# EAGLE design RetroBoard (EAGLE 6.1)
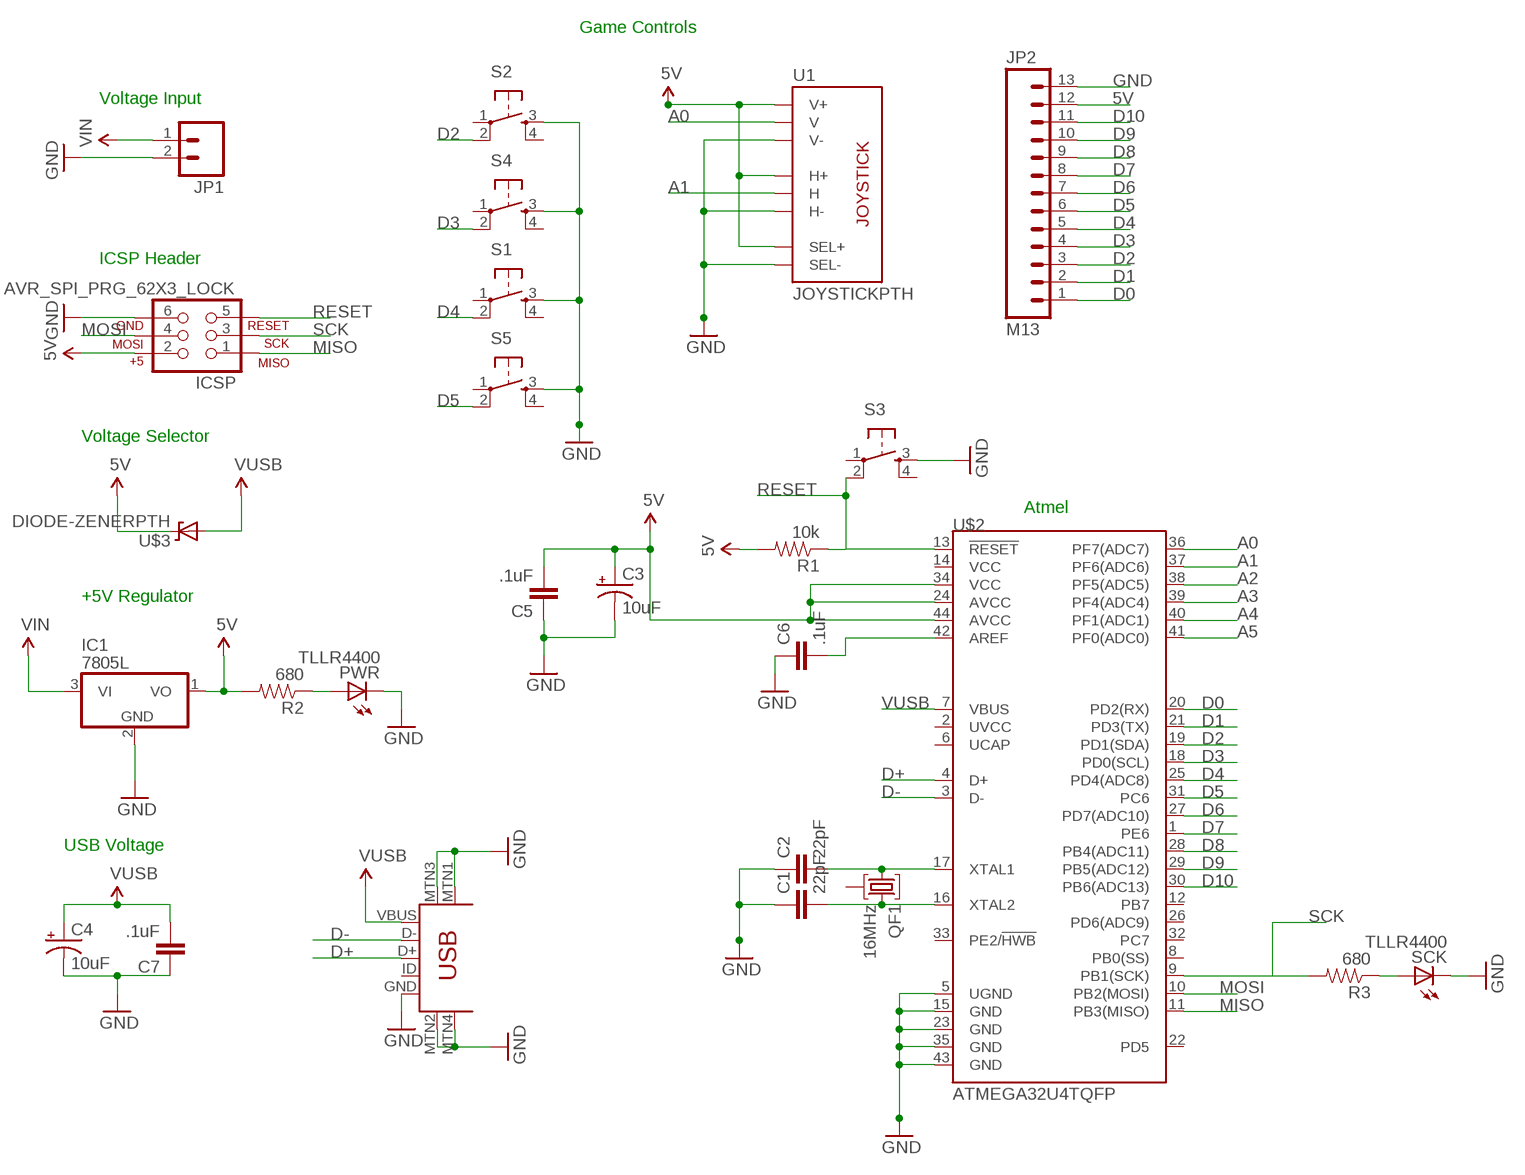
[diagram p0: schematic, sheet 1]

## Parts
C1  22pF  CAPEZ  [CAP-PTH-SMALLEZ]
C2  22pF  CAPEZ  [CAP-PTH-SMALLEZ]
C3  10uF  CAP_POLPTH4  [CPOL-RADIAL-1000UF-25V]
C4  10uF  CAP_POLPTH4  [CPOL-RADIAL-1000UF-25V]
C5  .1uF  CAPEZ  [CAP-PTH-SMALLEZ]
C6  .1uF  CAPEZ  [CAP-PTH-SMALLEZ]
C7  .1uF  CAPEZ  [CAP-PTH-SMALLEZ]
IC1  7805L  [TO92]
ICSP  AVR_SPI_PRG_62X3_LOCK  [2X3_LOCK]
JP1  M02LOCK  [1X02_LOCK]
JP2  M13  [1X13]
PWR  TLLR4400  [LED3MM]
QF1  16MHz  IXFA  [HC49U]
R1  10k  RESISTORAXIAL-0.3  [AXIAL-0.3]
R2  680  RESISTORAXIAL-0.3  [AXIAL-0.3]
R3  680  RESISTORAXIAL-0.3  [AXIAL-0.3]
S1  TAC_SWITCHSMD  [TACTILE_SWITCH_SMD]
S2  TAC_SWITCHPTH  [TACTILE-PTH]
S3  TAC_SWITCHPTH  [TACTILE-PTH]
S4  TAC_SWITCHPTH  [TACTILE-PTH]
S5  TAC_SWITCHPTH  [TACTILE-PTH]
SCK  TLLR4400  [LED3MM]
U1  JOYSTICKPTH  [JOYSTICK]
U$2  ATMEGA32U4TQFP  [SPARKFUN-DIGITALIC_TQFP44]
U$3  DIODE-ZENERPTH  [DIODE-ZENER]
USB  USB-MINIB-5PIN  [USB-MINIB]

## Nets
5V: C3.1(+) C5.2 IC1.1(VO) ICSP.2 JP2.12 R1.P$2 R2.P$2 U1.B1A(SEL+) U1.H1(H+) U1.V1(V+) U$2.24(AVCC) U$2.34(VCC) U$2.44(AVCC) U$3.P$1(C)
A0: U1.V2(V) U$2.36(PF7(ADC7))
A1: U1.H2(H) U$2.37(PF6(ADC6))
A2: U$2.38(PF5(ADC5))
A3: U$2.39(PF4(ADC4))
A4: U$2.40(PF1(ADC1))
A5: U$2.41(PF0(ADC0))
D0: JP2.1 U$2.20(PD2(RX))
D1: JP2.2 U$2.21(PD3(TX))
D2: JP2.3 S2.2 U$2.19(PD1(SDA))
D3: JP2.4 S4.2 U$2.18(PD0(SCL))
D4: JP2.5 S1.2 U$2.25(PD4(ADC8))
D5: JP2.6 S5.2 U$2.31(PC6)
D6: JP2.7 U$2.27(PD7(ADC10))
D7: JP2.8 U$2.1(PE6)
D8: JP2.9 U$2.28(PB4(ADC11))
D9: JP2.10 U$2.29(PB5(ADC12))
D10: JP2.11 U$2.30(PB6(ADC13))
D+: U$2.4(D+) USB.D+
D-: U$2.3(D-) USB.D-
GND: C1.1 C2.1 C3.2(-) C4.2(-) C5.1 C6.1 C7.1 IC1.2(GND) ICSP.6 JP1.2 JP2.13 PWR.K(C) S1.3 S2.3 S3.3 S4.3 S5.3 SCK.K(C) U1.B2A(SEL-) U1.H3(H-) U1.V3(V-) U$2.5(UGND) U$2.15(GND) U$2.23(GND) U$2.35(GND) U$2.43(GND) USB.GND USB.MTN1(MTN2) USB.MTN2(MTN3) USB.MTN3(MTN1) USB.MTN4
MISO: ICSP.1 U$2.11(PB3(MISO))
MOSI: ICSP.4 U$2.10(PB2(MOSI))
N$2: PWR.A R2.P$1
N$10: C2.2 QF1.1 U$2.17(XTAL1)
N$11: C1.2 QF1.3 U$2.16(XTAL2)
N$13: C6.2 U$2.42(AREF)
N$14: R3.P$1 SCK.A
RESET: ICSP.5 R1.P$1 S3.2 U$2.13(!RESET)
SCK: ICSP.3 R3.P$2 U$2.9(PB1(SCK))
VIN: C4.1(+) C7.2 IC1.3(VI) JP1.1 U$3.P$2(A) USB.VBUS ; supply symbol labelled VUSB
VUSB: U$2.7(VBUS)
Unconnected: QF1.2 S1.1 S1.4 S2.1 S2.4 S3.1 S3.4 S4.1 S4.4 S5.1 S5.4 U$2.2(UVCC) U$2.6(UCAP) U$2.8(PB0(SS)) U$2.12(PB7) U$2.14(VCC) U$2.22(PD5) U$2.26(PD6(ADC9)) U$2.32(PC7) U$2.33(PE2/!HWB) USB.ID

## Notes on the sheet
- Game Controls
- Voltage Input
- ICSP Header
- Voltage Selector
- Atmel
- +5V Regulator
- USB Voltage

## Library data of the parts
C1 C2 C5-C7 = SparkFun-Capacitors:CAP: Capacitor Standard 0603 ceramic capacitor, and 0.1" leaded capacitor.
C3 C4 = SparkFun-Passives:CAP_POL: Capacitor Polarized These are standard SMD and PTH capacitors. Normally 10uF, 47uF, and 100uF in electrolytic and tantalum varieties. Always verify the external diameter of the through hole cap, it varies with capacity, voltage, and manufacturer. The EIA devices should be standard.
IC1 = linear:78*: Positive VOLTAGE REGULATOR Source: http://cache.national.com/ds/LM/LM78L05.pdf http://www.fairchildsemi.com/ds/LM/LM7805.pdf
ICSP = SparkFun-Connectors:AVR_SPI_PRG_6: AVR ISP 6 Pin This is the reduced ISP connector for AVR programming. Common on Arduino. This footprint will take up less PCB space and can be used with a 10-pin to 6-pin adapter such as SKU: BOB-08508
JP1 = SparkFun-Connectors:M02: Header 2 Standard 2-pin 0.1" header. Use with straight break away headers (SKU : PRT-00116), right angle break away headers (PRT-00553), swiss pins (PRT-00743), machine pins (PRT-00117), and female headers (PRT-00115). Molex polarized connector foot print use with SKU : PRT-08233 with associated crimp pins and housings.
JP2 = SparkFun-Connectors:M13: 13-pin single row .1" header
PWR SCK = led:TLLR4400: Low Current (2mA) LED 3 mm Tinted Diffused Package color RED Source: Data sheet <http://www.farnell.com/datasheets/391100.pdf>; MF: VISHAY SEMICONDUCTOR; OC_FARNELL: 1612437
QF1 = crystal:IXF: Crystal Filter Source: www.ilsiamerica.com .. C1 IXF Series.pdf; OC_FARNELL: unknown; OC_NEWARK: unknown
R1-R3 = SparkFun-Passives:RESISTOR: Resistor Basic schematic elements and footprints for 0603, 1206, and PTH resistors.
S1 = SparkFun-Electromechanical:TAC_SWITCH: Momentary Switch Button commonly used for reset or general input. Spark Fun Electronics SKU : COM-00097 SMT- SWCH-08247; PROD_ID: SWCH-08247
S2-S5 = SparkFun-Electromechanical:TAC_SWITCH: Momentary Switch Button commonly used for reset or general input. Spark Fun Electronics SKU : COM-00097 SMT- SWCH-08247
U1 = SparkFun-Electromechanical:JOYSTICK: Thumb Joystick Joystick commonly found in PS2 controllers. Two pots and a select switch. Footprint proven. Spark Fun Electronics SKU : COM-09032
U$2 = SparkFun-DigitalIC:ATMEGA32U4: Atmel 44-pin 8-bit Microcontroller with 32KBytes of ISP Flash and USB Controller
U$3 = SparkFun-DiscreteSemi:DIODE-ZENER: Zener Diode Production Part - 8199 3.4V Zener Voltage
USB = SparkFun-Connectors:USB-MINIB: Mini-USB "B" connector with 5th pin broken out. Created new symbol breaking out 5th "ID" pin in mini/micro USB connector spec. See: http://en.wikipedia.org/wiki/Mini_usb#Cables. Uses same footprint as 4-pin symbol. Also added pins to connect to mounting / shield pads if required (probably not generally needed as signals aren't shielded once they leave the connector).

## Net classes
0 default: width 0.305 mm, drill 0.508 mm, clearance 0.254 mm

## Board
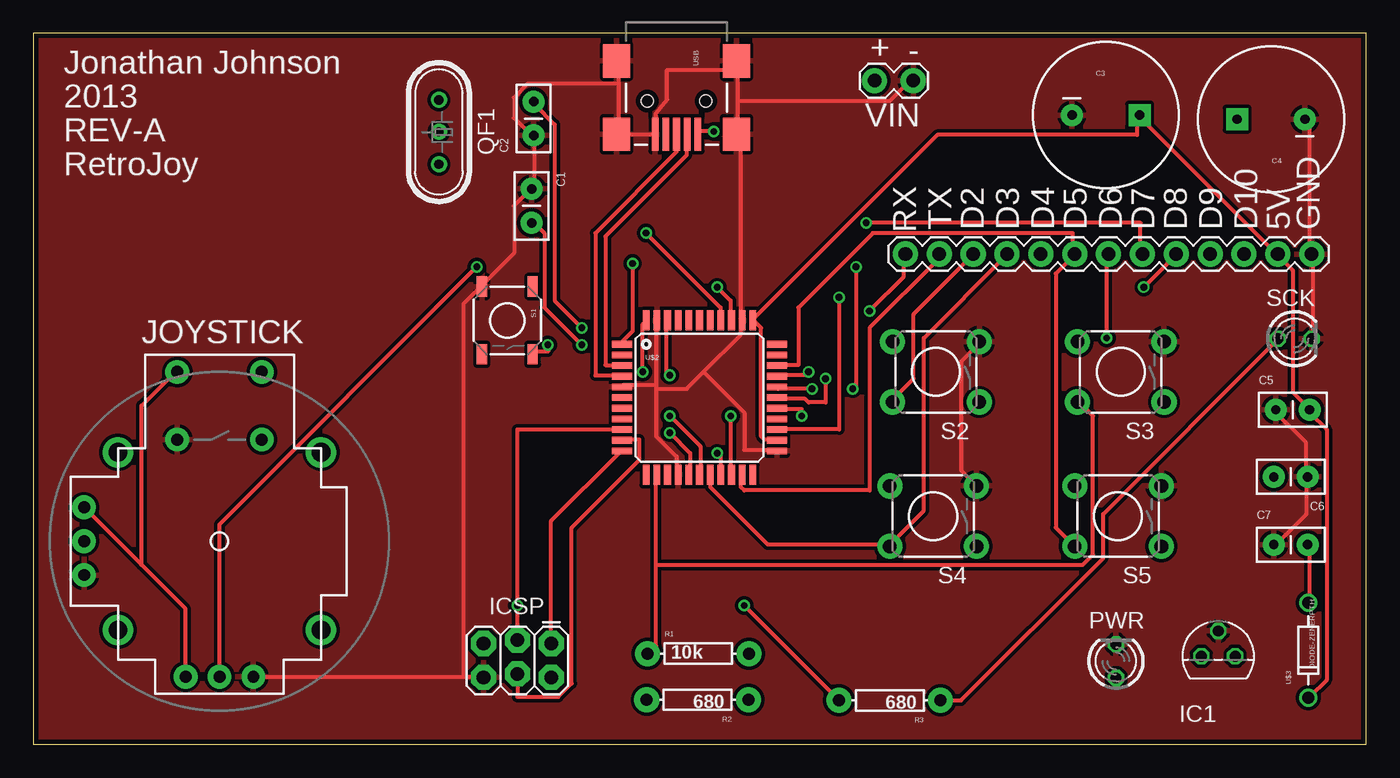
[diagram p1: board, top side]
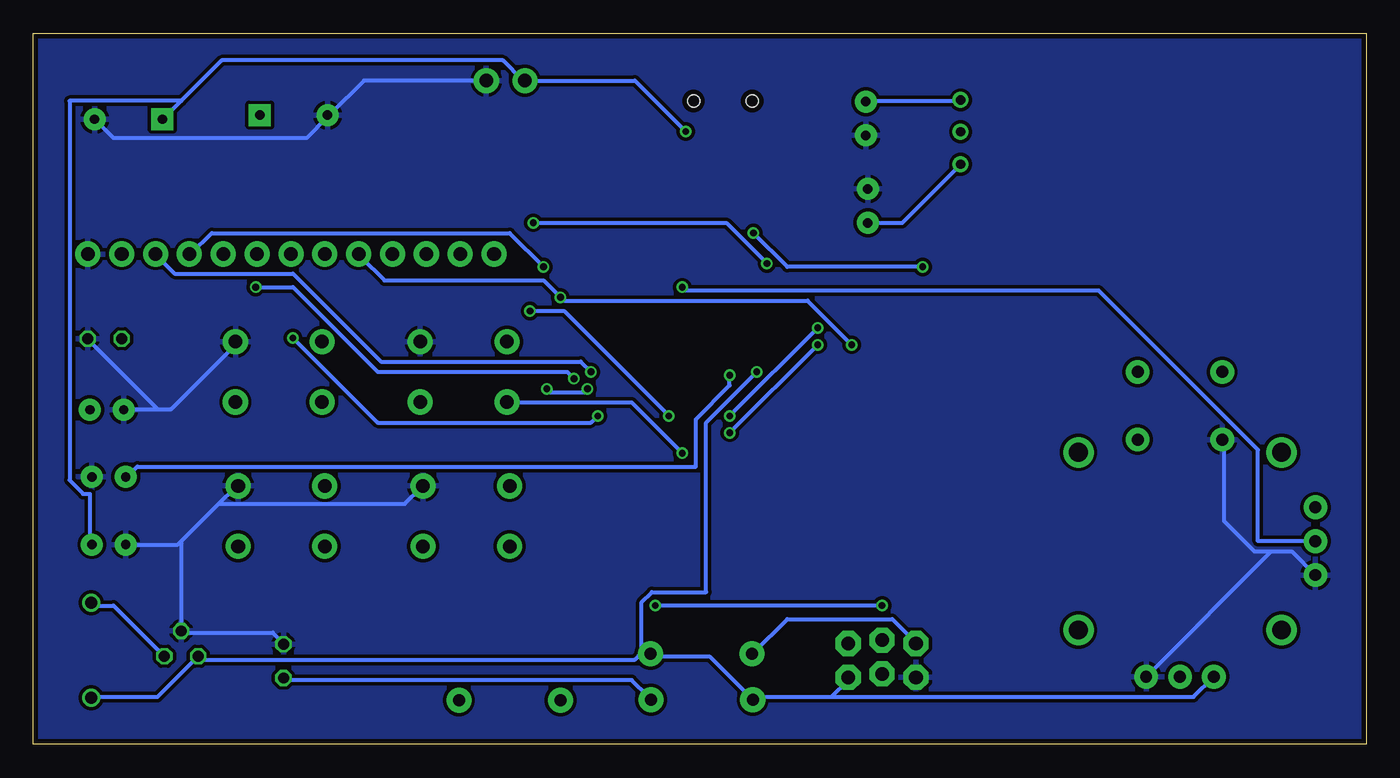
[diagram p2: board, bottom side, seen from below]

Size 100 x 53.33 mm. Coordinates in mm from the lower left corner, seen from the top.
Outline: 0,0 100,0 100,53.33 0,53.33 0,0
Copper layers (1*16): Top 0.0356mm / dielectric 1.5011mm / Bottom 0.0356mm
Design rules: minimum track width 6mil, minimum drill 13mil, track to track 6mil, track to pad 6mil, pad to pad 6mil, via to via 6mil, smd to smd 6mil, copper to edge 15mil, drill to drill 6mil, minimum pad ring 7mil, minimum via ring 7mil, stop-mask expansion 3mil, vias tented up to drill 0mil, thermal gap 10mil

### Footprints (pad centres in the part's own frame; a part is rotated, then mirrored left to right if it is on the bottom)
CAP-PTH-SMALLEZ = drill 0.7 pad 1.651: 1 0,0; 2 2.54,0
CPOL-RADIAL-1000UF-25V = drill 0.7 pad 1.651 square: 1 2.54,0 | drill 0.7 pad 1.651: 2 -2.54,0
TO92 = drill 0.813 octagon: 1 -1.27,0; 2 0,1.905; 3 1.27,0
2X3_LOCK = drill 1.016 pad 1.88 octagon: 1 0,0; 2 0,2.54; 3 2.54,-0.254; 4 2.54,2.286; 5 5.08,0; 6 5.08,2.54
1X02_LOCK = drill 1.016 pad 1.88: 1 -0.178,0; 2 2.718,0
1X13 = drill 1.016 pad 1.88: 1 0,0; 2 2.54,0; 3 5.08,0; 4 7.62,0; 5 10.16,0; 6 12.7,0; 7 15.24,0; 8 17.78,0; 9 20.32,0; 10 22.86,0; 11 25.4,0; 12 27.94,0; 13 30.48,0
LED3MM = drill 0.813 octagon: A -1.27,0; K 1.27,0
HC49U = drill 0.7 pad 1.2: 1 -2.413,0; 2 -0.027,0; 3 2.413,0
AXIAL-0.3 = drill 0.9 pad 1.88: P$1 -3.81,0; P$2 3.81,0
TACTILE_SWITCH_SMD = smd 1.524 x 0.762: 1 -2.54,1.905; 2 2.54,1.905; 3 -2.54,-1.905; 4 2.54,-1.905
TACTILE-PTH = drill 1.016 pad 1.88: 1 -3.251,2.261; 2 3.251,2.261; 3 -3.251,-2.261; 4 3.251,-2.261
JOYSTICK = drill 0.9 pad 1.778: B1A -3.175,12.7; B1B 3.175,12.7; B2A -3.175,7.62; B2B 3.175,7.62 | drill 0.889 pad 1.778: H1 -2.54,-10.16; H2 0,-10.16; H3 2.54,-10.16; V1 -10.16,2.54; V2 -10.16,0; V3 -10.16,-2.54 | drill 1.397 pad 2.286: MOUNT1 -7.62,6.668; MOUNT2 -7.62,-6.668; MOUNT3 7.62,-6.668; MOUNT4 7.62,6.668
SPARKFUN-DIGITALIC_TQFP44 = smd 1.5 x 0.5: 1 -5.8,4; 2 -5.8,3.2; 3 -5.8,2.4; 4 -5.8,1.6; 5 -5.8,0.8; 6 -5.8,0; 7 -5.8,-0.8; 8 -5.8,-1.6; 9 -5.8,-2.4; 10 -5.8,-3.2; 11 -5.8,-4; 23 5.8,-4; 24 5.8,-3.2; 25 5.8,-2.4; 26 5.8,-1.6; 27 5.8,-0.8; 28 5.8,0; 29 5.8,0.8; 30 5.8,1.6; 31 5.8,2.4; 32 5.8,3.2; 33 5.8,4 | smd 0.5 x 1.5: 12 -4,-5.8; 13 -3.2,-5.8; 14 -2.4,-5.8; 15 -1.6,-5.8; 16 -0.8,-5.8; 17 0,-5.8; 18 0.8,-5.8; 19 1.6,-5.8; 20 2.4,-5.8; 21 3.2,-5.8; 22 4,-5.8; 34 4,5.8; 35 3.2,5.8; 36 2.4,5.8; 37 1.6,5.8; 38 0.8,5.8; 39 0,5.8; 40 -0.8,5.8; 41 -1.6,5.8; 42 -2.4,5.8; 43 -3.2,5.8; 44 -4,5.8
DIODE-ZENER = drill 0.9: P$1 -3.556,0; P$2 3.556,0
USB-MINIB = smd 2.5 x 0.5: D+ 2.5,0; D- 2.5,0.8; GND 2.5,-1.6; ID 2.5,-0.8; VBUS 2.5,1.6 | smd 2.5 x 2: MTN1 -3,4.5; MTN2 2.5,4.5; MTN3 -3,-4.5; MTN4 2.5,-4.5 | hole 0.9: 0,2.2; 0,-2.2

### Placement (x,y rotation side)
C1  37.39,41.66 270 top
C2  37.54,45.67 90 top
C3  80.47,47.19 0 top
C4  92.86,46.89 180 top
C5  93.22,25.1 0 top
C6  95.61,20.07 180 top
C7  93.07,14.99 0 top
IC1  88.9,6.6 0 top
ICSP  38.86,7.57 180 top
JP1  63.3,49.78 0 top
JP2  65.43,36.78 0 top
PWR  81.23,6.25 90 top
QF1  30.43,45.92 270 top
R1  49.89,6.81 0 top
R2  49.83,3.35 180 top
R3  64.26,3.3 180 top
S1  35.56,31.8 270 top
S2  67.72,27.94 180 top
S3  81.58,27.94 180 top
S4  67.51,17.12 180 top
S5  81.38,17.12 180 top
SCK  94.64,30.43 0 top
U1  13.97,15.24 0 top
U$2  49.99,26.01 0 top
U$3  95.66,7.06 90 top
USB  48.26,48.26 270 top

### Tracks (layer width: path | path; a pad name or v marks a point on that pad's centre or on a via)
5V  (via drill 0.51)
  Top 0.305: 8.13,13.46 11.43,10.16 U1.H1 | 8.13,13.46 U1.V1 | 8.13,13.46 8.13,25.4 10.67,27.94 U1.B1A | v45.72,27.94 45.72,31.5 45.97,31.75 U$2.44 | U$2.24 55.63,22.86 54.86,22.86 54.61,23.11 54.61,31.24 54.1,31.75 U$2.34 54.1,32 67.82,45.72 82.8,45.72 82.8,46.99 C3.1 83.06,46.99 93.22,36.83 JP2.12 93.47,36.58 94.49,35.56 94.49,26.42 95.76,25.15 C5.2 95.76,24.89 97.03,23.62 97.03,4.83 95.76,3.56 U$3.P$1
  Bottom 0.305: 40.13,3.56 38.86,4.83 ICSP.2 | 40.13,3.56 45.97,3.56 R2.P$2 46.23,3.56 49.28,6.6 53.59,6.6 R1.P$2 | v45.72,27.94 49.53,24.13 49.53,11.43 53.59,11.43 54.36,10.67 54.36,6.86 | 54.36,6.86 53.85,6.86 R1.P$2 | U1.H1 12.95,3.56 40.13,3.56 | 87.88,6.35 90.68,3.56 95.5,3.56 U$3.P$1 | 87.88,6.35 IC1.1 87.88,6.35 | 54.36,6.86 54.86,6.35 87.88,6.35 | 54.36,6.86 R1.P$2
A0  (via drill 0.51)
  Top 0.305: v51.31,34.29 52.32,33.27 52.32,32 U$2.36
  Bottom 0.305: v51.31,34.29 51.05,34.04 20.07,34.04 8.13,22.1 8.13,15.24 U1.V2
A1  (via drill 0.51)
  Top 0.305: v45.97,38.35 51.56,32.77 51.56,32 U$2.37 | v33.27,35.81 13.97,16.51 U1.H2
  Bottom 0.305: v45.97,38.35 43.43,35.81 v33.27,35.81
D0  (via drill 0.51)
  Top 0.305: v52.32,24.64 52.32,20.32 U$2.20 | v62.74,32.51 65.28,35.05 65.28,36.58 JP2.1
  Bottom 0.305: v52.32,24.64 60.2,32.51 v62.74,32.51
D1
  Top 0.305: U$2.21 53.09,20.07 53.09,19.3 53.34,19.05 62.74,19.05 62.74,31.24 67.82,36.32 67.82,36.58 JP2.2
D2  (via drill 0.51)
  Top 0.305: v51.31,21.84 51.56,21.59 51.56,20.32 U$2.19 | JP2.3 70.36,36.58 66.04,32.26 66.04,27.43 64.52,25.91 S2.2
  Bottom 0.305: v51.31,21.84 55.12,25.65 64.26,25.65 S2.2
D3
  Top 0.305: 64.26,14.99 55.12,14.99 50.8,19.3 50.8,20.07 U$2.18 | 64.26,14.99 S4.2 64.26,14.99 | 64.26,14.99 66.8,17.53 66.8,30.48 72.9,36.58 JP2.4
D4  (via drill 0.51)
  Top 0.305: v60.45,33.53 60.45,23.62 55.88,23.62 U$2.25 | v38.61,29.97 38.61,29.46 37.59,29.46 S1.2
  Bottom 0.305: JP2.5 75.44,36.58 73.66,34.8 61.72,34.8 v60.45,33.53 60.2,33.27 41.91,33.27 v38.61,29.97
D5
  Top 0.305: U$2.31 55.88,28.45 57.4,28.45 57.4,32.77 62.99,38.35 77.98,38.35 77.98,36.83 JP2.6 77.98,36.58 76.71,35.31 76.71,16.26 77.98,14.99 S5.2
D6  (via drill 0.51)
  Top 0.305: v57.66,24.64 57.66,25.15 55.88,25.15 U$2.27 | v80.52,30.48 80.52,36.58 JP2.7
  Bottom 0.305: v57.66,24.64 58.17,24.13 74.17,24.13 v80.52,30.48
D7  (via drill 0.51)
  Top 0.305: v44.96,36.07 44.96,30.99 44.2,30.23 U$2.1 | v62.48,39.12 83.06,39.12 83.06,36.83 JP2.8
  Bottom 0.305: v44.96,36.07 48.01,39.12 v62.48,39.12
D8  (via drill 0.51)
  Top 0.305: v59.44,27.43 59.44,25.65 58.17,25.65 57.91,25.91 55.88,25.91 U$2.28 | v83.31,34.29 85.6,36.58 JP2.9
  Bottom 0.305: v59.44,27.43 59.94,27.94 74.17,27.94 80.52,34.29 v83.31,34.29
D9  (via drill 0.51)
  Top 0.305: v58.42,26.67 55.88,26.67 U$2.29 | v61.47,26.67 61.72,26.92 v61.72,35.81
  Bottom 0.305: v58.42,26.67 58.67,26.42 61.21,26.42 v61.47,26.67 | v61.72,35.81 64.26,38.35 86.61,38.35 88.14,36.83 JP2.10
D10  (via drill 0.51)
  Top 0.305: v58.17,27.94 58.17,27.69 55.88,27.69 U$2.30
  Bottom 0.305: v58.17,27.94 58.93,28.7 73.91,28.7 80.52,35.31 89.41,35.31 90.68,36.58 JP2.11
D+
  Top 0.305: U$2.4 43.94,27.69 42.16,27.69 42.16,38.35 48.26,44.45 48.26,45.72 USB.D+
D-
  Top 0.305: U$2.3 43.94,28.45 42.93,28.45 42.93,38.1 49.02,44.2 49.02,45.72 USB.D-
GND
  Top 0.305: SCK.K 96.01,30.48 96.01,36.58 JP2.13 95.76,36.83 95.76,46.48 95.5,46.74 C4.2 | S4.3 70.61,19.56 69.6,20.57 69.6,28.7 70.87,29.97 S2.3 | 95.5,20.07 95.5,17.27 93.22,14.99 C7.1 | 95.5,20.07 C6.1 95.5,20.07 | 95.5,20.07 95.5,22.61 93.22,24.89 C5.1 | U1.H3 32.26,5.08 | 32.26,5.08 33.78,5.08 ICSP.6 | 52.83,48.26 52.83,51.05 USB.MTN1 | 52.83,48.26 52.83,47.5 | 52.83,47.5 52.83,45.97 USB.MTN2 52.83,45.72 53.09,45.47 53.09,32 U$2.35 53.09,31.75 53.09,30.73 50.29,27.94 | 43.94,49.53 43.94,45.97 USB.MTN4 43.94,45.72 46.48,45.72 USB.GND 46.74,45.97 46.74,47.09 46.74,47.35 47.55,48.36 47.55,50.6 52.83,50.6 52.83,47.5 | 43.94,49.53 43.94,51.05 USB.MTN3 | 46.74,26.92 44.2,26.92 U$2.5 | 46.74,26.92 46.74,31.75 U$2.43 | 46.74,26.92 46.74,26.67 | 46.74,26.67 46.74,23.11 48.26,21.59 48.26,20.32 U$2.15 | 50.29,27.94 49.02,26.67 46.74,26.67 | 50.29,27.94 53.34,24.89 53.34,22.1 55.63,22.1 U$2.23 | 43.94,49.53 37.08,49.53 36.07,48.51 36.07,46.99 37.34,45.72 C2.1 37.59,45.47 37.59,41.66 C1.1 37.34,41.66 36.07,40.39 36.07,36.83 33.78,34.54 S1.3 33.53,34.29 32.26,33.02 32.26,5.08 | 52.83,48.26 64.26,48.26 65.79,49.78 JP1.2
  Bottom 0.305: PWR.K 81.28,7.62 82.04,8.38 88.9,8.38 IC1.2 88.9,8.64 88.9,15.24 | 88.9,15.24 89.15,14.99 92.96,14.99 C7.1 | 88.9,15.24 86.11,18.03 | 86.11,18.03 84.84,19.3 S5.3 | 90.68,25.15 93.22,25.15 C5.1 | 90.68,25.15 89.66,25.15 84.84,29.97 S3.3 | 86.11,18.03 72.14,18.03 70.87,19.3 S4.3 | 90.68,25.15 95.76,30.23 SCK.K | U1.V3 5.59,14.48 7.11,14.48 | 7.11,14.48 8.38,14.48 10.67,16.76 10.67,22.86 U1.B2A | 7.11,14.48 U1.H3 | JP1.2 66.04,49.78 75.18,49.78 77.72,47.24 C3.2 77.98,46.99 79.5,45.47 93.98,45.47 95.25,46.74 C4.2
  pour Top: -0.61,54.05 -0.61,-0.81 -0.81,-1.02 100.58,-1.02 100.99,-0.61 100.99,54.46 -0.61,54.46 -0.81,54.25
  pour Bottom: -0.81,54.46 -0.81,-1.02 -0.61,-1.22 100.18,-1.22 100.99,-0.41 100.99,54.46
MISO
  Top 0.305: U$2.11 43.94,21.84 38.86,16.76 38.86,7.62 ICSP.1
MOSI
  Top 0.305: U$2.10 44.2,22.86 45.47,22.86 45.47,21.34 40.39,16.26 40.39,4.57 39.37,3.56 36.32,3.56 36.32,5.08 ICSP.4
N$2
  Bottom 0.305: PWR.A 81.03,4.83 55.12,4.83 53.85,3.56 R2.P$1
N$10  (via drill 0.51)
  Top 0.305: v47.75,24.64 50.04,22.35 50.04,20.32 U$2.17 | v41.15,31.24 39.12,33.27 39.12,46.48 37.59,48.01 C2.2
  Bottom 0.305: v41.15,31.24 v47.75,24.64 | QF1.1 30.48,48.26 37.34,48.26 C2.2
N$11  (via drill 0.51)
  Top 0.305: v47.75,23.37 49.28,21.84 49.28,20.32 U$2.16 | v41.15,29.97 38.35,32.77 38.35,38.35 37.59,39.12 C1.2
  Bottom 0.305: v41.15,29.97 v47.75,23.37 | QF1.3 30.48,43.43 34.8,39.12 37.34,39.12 C1.2
N$13  (via drill 0.51)
  Top 0.305: v47.75,27.69 47.5,27.94 47.5,31.75 U$2.42
  Bottom 0.305: v47.75,27.69 47.75,26.92 50.29,24.38 50.29,20.83 92.2,20.83 92.96,20.07 C6.2
N$14
  Top 0.305: R3.P$1 69.6,3.3 80.26,13.97 80.26,17.27 93.22,30.23 SCK.A
RESET
  Top 0.305: 46.74,13.46 46.74,7.37 46.23,6.86 R1.P$1 | 46.74,13.46 46.74,20.07 U$2.13 | 46.74,13.46 78.74,13.46 79.5,14.22 79.5,24.64 78.49,25.65 S3.2
  Bottom 0.305: ICSP.5 33.78,7.62 35.56,9.4 43.43,9.4 45.97,6.86 R1.P$1
SCK  (via drill 0.51)
  Top 0.305: U$2.9 43.94,23.62 36.32,23.62 v36.32,10.41 36.32,7.87 ICSP.3 | v53.34,10.41 R3.P$2
  Bottom 0.305: v36.32,10.41 v53.34,10.41
VIN  (via drill 0.51)
  Top 0.305: C7.2 95.76,14.99 95.76,10.67 U$3.P$2 | v51.05,45.97 50.04,45.97 USB.VBUS
  Bottom 0.305: IC1.3 93.98,10.41 95.5,10.41 U$3.P$2 | v51.05,45.97 54.86,49.78 62.99,49.78 JP1.1 63.25,49.78 64.77,51.31 85.85,51.31 88.9,48.26 | 88.9,48.26 90.17,46.99 C4.1 | 88.9,48.26 97.28,48.26 97.28,19.81 96.27,18.8 95.76,18.8 95.76,14.99 C7.2

### Text on the board
tPlace: + | - | VIN | TX | D2 | D3 | D4 | D5 | D6 | D7 | D8 | D9 | D10 | 5V | GND | RX | JOYSTICK
tNames: Jonathan Johnson | 2013 | REV-A | RetroJoy